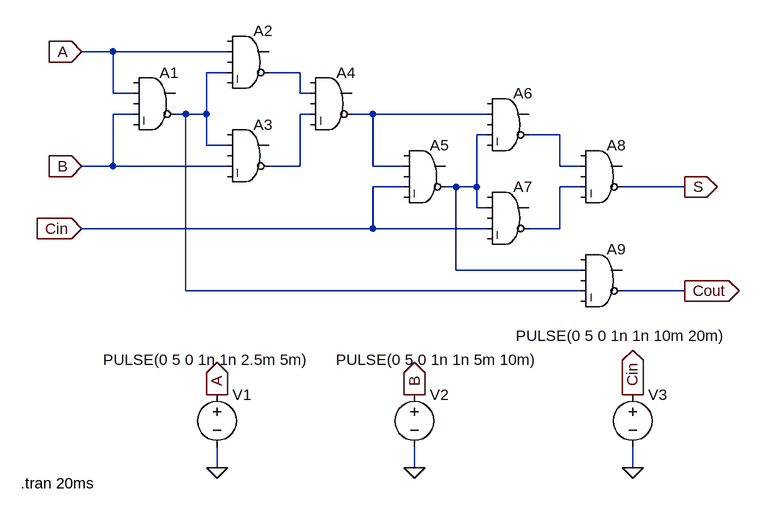
[diagram p0: schematic part1_simulatedCircuit.asc]
part1_simulatedCircuit.asc, the LTspice schematic file:
Version 4
SHEET 1 1040 712
WIRE -128 32 -176 32
WIRE 48 32 -128 32
WIRE 48 64 16 64
WIRE 160 64 112 64
WIRE -128 96 -128 32
WIRE -96 96 -128 96
WIRE 160 96 160 64
WIRE 176 96 160 96
WIRE -96 128 -128 128
WIRE -16 128 -32 128
WIRE 16 128 16 64
WIRE 16 128 -16 128
WIRE 176 128 160 128
WIRE 272 128 240 128
WIRE 448 128 272 128
WIRE 448 160 432 160
WIRE 560 160 512 160
WIRE 16 176 16 128
WIRE 48 176 16 176
WIRE -128 208 -128 128
WIRE -128 208 -176 208
WIRE 48 208 -128 208
WIRE 160 208 160 128
WIRE 160 208 112 208
WIRE 272 208 272 128
WIRE 320 208 272 208
WIRE 560 208 560 160
WIRE 592 208 560 208
WIRE 320 240 272 240
WIRE 400 240 384 240
WIRE 432 240 432 160
WIRE 432 240 400 240
WIRE 592 240 560 240
WIRE 752 240 656 240
WIRE 432 272 432 240
WIRE 448 272 432 272
WIRE 272 304 272 240
WIRE 272 304 -176 304
WIRE 448 304 272 304
WIRE 560 304 560 240
WIRE 560 304 512 304
WIRE 400 368 400 240
WIRE 592 368 400 368
WIRE -16 400 -16 128
WIRE 592 400 -16 400
WIRE 752 400 656 400
WIRE 32 672 32 640
WIRE 336 672 336 640
WIRE 672 672 672 640
FLAG -176 32 A
IOPIN -176 32 In
FLAG -176 208 B
IOPIN -176 208 In
FLAG -176 304 Cin
IOPIN -176 304 In
FLAG 752 240 S
IOPIN 752 240 Out
FLAG 752 400 Cout
IOPIN 752 400 Out
FLAG 32 560 A
IOPIN 32 560 Out
FLAG 336 560 B
IOPIN 336 560 Out
FLAG 672 560 Cin
IOPIN 672 560 Out
FLAG 32 672 0
FLAG 336 672 0
FLAG 672 672 0
SYMBOL Digital\\and -64 48 R0
SYMATTR InstName A1
SYMBOL Digital\\and 80 -16 R0
SYMATTR InstName A2
SYMBOL Digital\\and 80 128 R0
SYMATTR InstName A3
SYMBOL Digital\\and 208 48 R0
SYMATTR InstName A4
SYMBOL Digital\\and 352 160 R0
SYMATTR InstName A5
SYMBOL Digital\\and 480 80 R0
SYMATTR InstName A6
SYMBOL Digital\\and 480 224 R0
SYMATTR InstName A7
SYMBOL Digital\\and 624 160 R0
SYMATTR InstName A8
SYMBOL Digital\\and 624 320 R0
SYMATTR InstName A9
SYMBOL voltage 32 544 R0
WINDOW 3 -175 -38 Left 2
WINDOW 123 0 0 Left 0
WINDOW 39 0 0 Left 0
SYMATTR InstName V1
SYMATTR Value PULSE(0 5 0 1n 1n 2.5m 5m)
SYMBOL voltage 336 544 R0
WINDOW 3 -121 -38 Left 2
WINDOW 123 0 0 Left 0
WINDOW 39 0 0 Left 0
SYMATTR InstName V2
SYMATTR Value PULSE(0 5 0 1n 1n 5m 10m)
SYMBOL voltage 672 544 R0
WINDOW 3 -180 -75 Left 2
WINDOW 123 0 0 Left 0
WINDOW 39 0 0 Left 0
SYMATTR InstName V3
SYMATTR Value PULSE(0 5 0 1n 1n 10m 20m)
TEXT -270 696 Left 2 !.tran 20ms

The netlist it stands for:
* part1_simulatedCircuit.asc
A1 0 A 0 B 0 N001 0 0 AND
A2 0 A 0 N001 0 N002 0 0 AND
A3 0 N001 0 B 0 N003 0 0 AND
A4 0 N002 0 N003 0 N004 0 0 AND
A5 0 N004 0 Cin 0 N005 0 0 AND
A6 0 N004 0 N005 0 N006 0 0 AND
A7 0 N005 0 Cin 0 N007 0 0 AND
A8 0 N006 0 N007 0 S 0 0 AND
A9 0 N005 0 N001 0 Cout 0 0 AND
V1 A 0 PULSE(0 5 0 1n 1n 2.5m 5m)
V2 B 0 PULSE(0 5 0 1n 1n 5m 10m)
V3 Cin 0 PULSE(0 5 0 1n 1n 10m 20m)
.tran 20ms
.backanno
.end